# EAGLE design irisc (EAGLE 9.2.2)
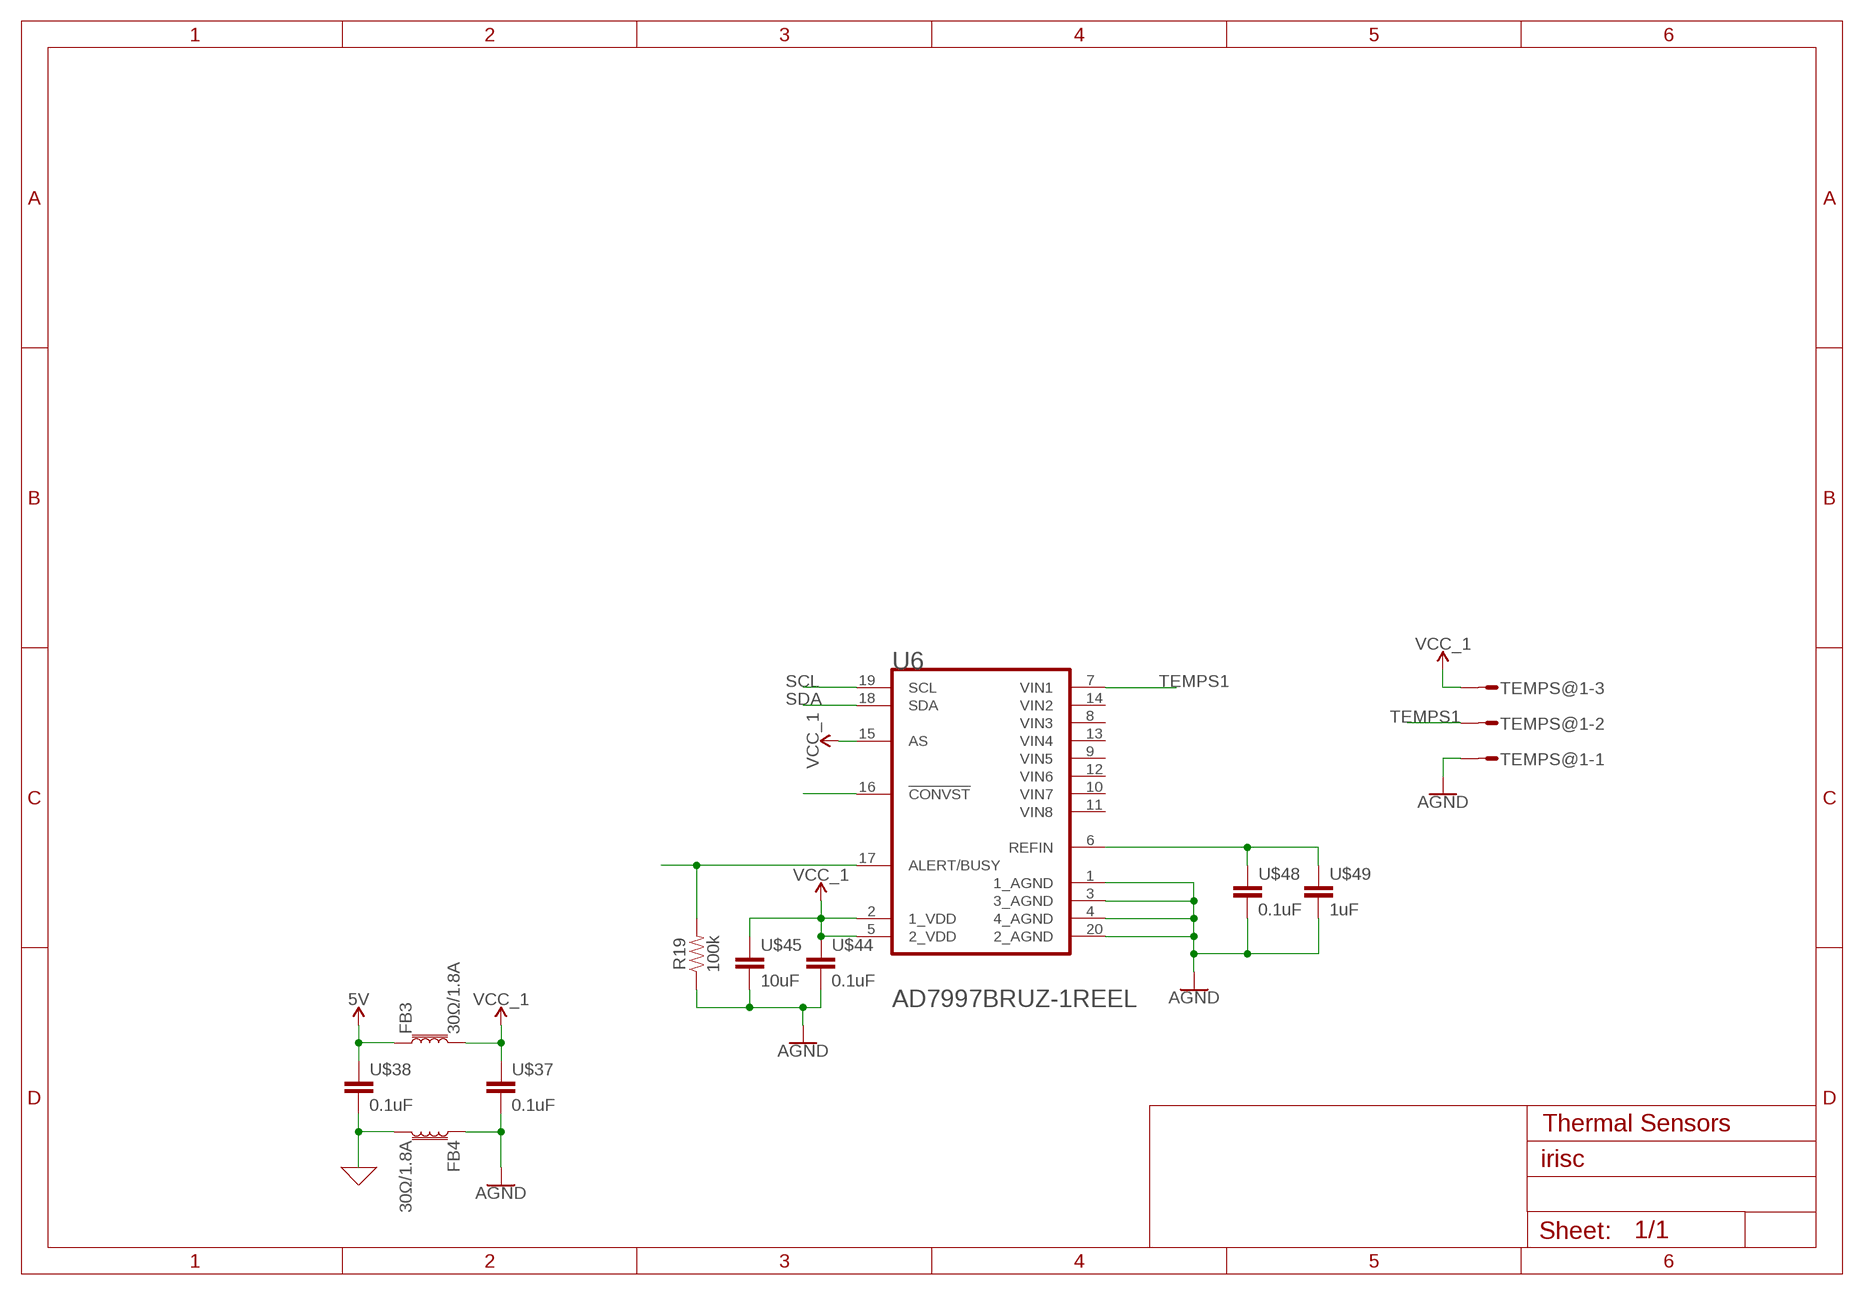
[diagram p0: schematic, sheet 1]

## Parts
FB3  30Ω/1.8A  FERRITE_BEAD-0603  [0603]
FB4  30Ω/1.8A  FERRITE_BEAD-0603  [0603]
R19  100k  100KOHM-0603-1/10W-1%  [0603]
TEMPS@1  L03P  [L03P]
U6  ANALOG_DEVICES_AD7997BRUZ-1REELANALOG_DEVICES_AD7997BRUZ-1REEL_0_0  [ANALOG_DEVICES_AD7997BRUZ-1REEL_0]
U$37  0.1uF  CAPACITOR_0603_N  [RESC0603_N]
U$38  0.1uF  CAPACITOR_0603_N  [RESC0603_N]
U$44  0.1uF  CAPACITOR_0603_N  [RESC0603_N]
U$45  10uF  CAPACITOR_0805_L  [RESC0805_L]
U$48  0.1uF  CAPACITOR_0603_N  [RESC0603_N]
U$49  1uF  CAPACITOR_0603_N  [RESC0603_N]

## Nets
0: FB4.2 U$38.2 ; supply symbol labelled GND
5V: FB3.1 U$38.1
AGND: FB4.1 R19.1 TEMPS@1.1 U6.1(1_AGND) U6.3(3_AGND) U6.4(4_AGND) U6.20(2_AGND) U$37.2 U$44.2 U$45.2 U$48.2 U$49.2
N$63: U6.6(REFIN) U$48.1 U$49.1
N$67: R19.2 U6.17(ALERT/BUSY)
N$68: U6.16(!CONVST!)
SCL: U6.19(SCL)
SDA: U6.18(SDA)
TEMPS1: TEMPS@1.2 U6.7(VIN1)
VCC_1: FB3.2 TEMPS@1.3 U6.2(1_VDD) U6.5(2_VDD) U6.15(AS) U$37.1 U$44.1 U$45.1
Unconnected: U6.8(VIN3) U6.9(VIN5) U6.10(VIN7) U6.11(VIN8) U6.12(VIN6) U6.13(VIN4) U6.14(VIN2)

## Notes on the sheet
- Thermal Sensors

## Library data of the parts
FB3 FB4 = SparkFun-Coils:FERRITE_BEAD: Ferrite Bead (blocks, cores, rings, chokes, etc.) Inductor with layers of ferrite used to suppress high frequencies. Often used to isolate high frequency noise. SparkFun Products: IOIO-OTG - V2.2 <https://www.sparkfun.com/products/13613> SparkFun SAMD21 Mini Breakout <https://www.sparkfun.com/products/13664> SparkFun 6 Degrees of Freedom Breakout - LSM6DS3 <https://www.sparkfun.com/products/13339> SparkFun SAMD21 Dev Breakout <https://www.sparkfun.com/products/13672>; PROD_ID: NDUC-07859
R19 = SparkFun-Resistors:100KOHM: 100kΩ resistor A resistor is a passive two-terminal electrical component that implements electrical resistance as a circuit element. Resistors act to reduce current flow, and, at the same time, act to lower voltage levels within circuits. - Wikipedia; PROD_ID: RES-07828
TEMPS@1 = con-amp-mt:L03P: AMP MT CONNECTOR; OC_FARNELL: unknown; OC_NEWARK: unknown
U6 = Analog Devices - AD7997BRUZ-1REEL:ANALOG_DEVICES_AD7997BRUZ-1REEL: ADI-AD7997-RU-20; CHANNELS: 8; CIIVA_IDS: 4380982; CODE__JEDEC: MO-153AC; COMPONENT_LINK_1_DESCRIPTION: Manufacturer URL; COMPONENT_LINK_1_URL: http://www.analog.com/en/index.html; COMPONENT_LINK_3_DESCRIPTION: Package Specification; COMPONENT_LINK_3_URL: http://www.analog.com/static/imported-files/packages/364515793657813558433715854054607941441RU20.pdf; COMPONENT_LINK_4_DESCRIPTION: Product URL; COMPONENT_LINK_4_URL: http://www.analog.com/en/analog-to-digital-converters/ad-converters/ad7997/products/product.html; DATASHEET: http://www.analog.com/static/imported-files/data_sheets/AD7997_7998.pdf; DATASHEET_VERSION: Rev.0; FOOTPRINT_VARIANT_NAME_0: Level C; FOOTPRINT_VARIANT_NAME_1: Level B; FOOTPRINT_VARIANT_NAME_2: Level A; IMPORTED: yes; IMPORTED_FROM: vault; IMPORT_TS: 1521848429; INTERFACE: I2C/Ser 2-Wire, Ser; MF: Analog Devices; MOUNTING_TECHNOLOGY: Surface Mount; MPN: AD7997BRUZ-1REEL; PACKAGE: RU-20; PACKAGE_DESCRIPTION: 20-Lead Thin Shrink Small Outline Package [TSSOP]; PACKAGE_VERSION: 2000; PACKING: Reel; PREFIX: U; RELEASE_DATE: 1387032128; RESOLUTION_BITS: 10; ROHS: Yes; THROUGHPUT_RATE_SPS: 79K; VAULT_GUID: A7ABE123-3A90-4C1F-BE7E-7FE114D63781; VAULT_REVISION: 98AE87BF-701A-419B-8AC8-345A379FE084
U$37 U$38 U$44 U$45 U$48 U$49 = Nordic_nRF:CAPACITOR: Generic chip capacitor

## Board
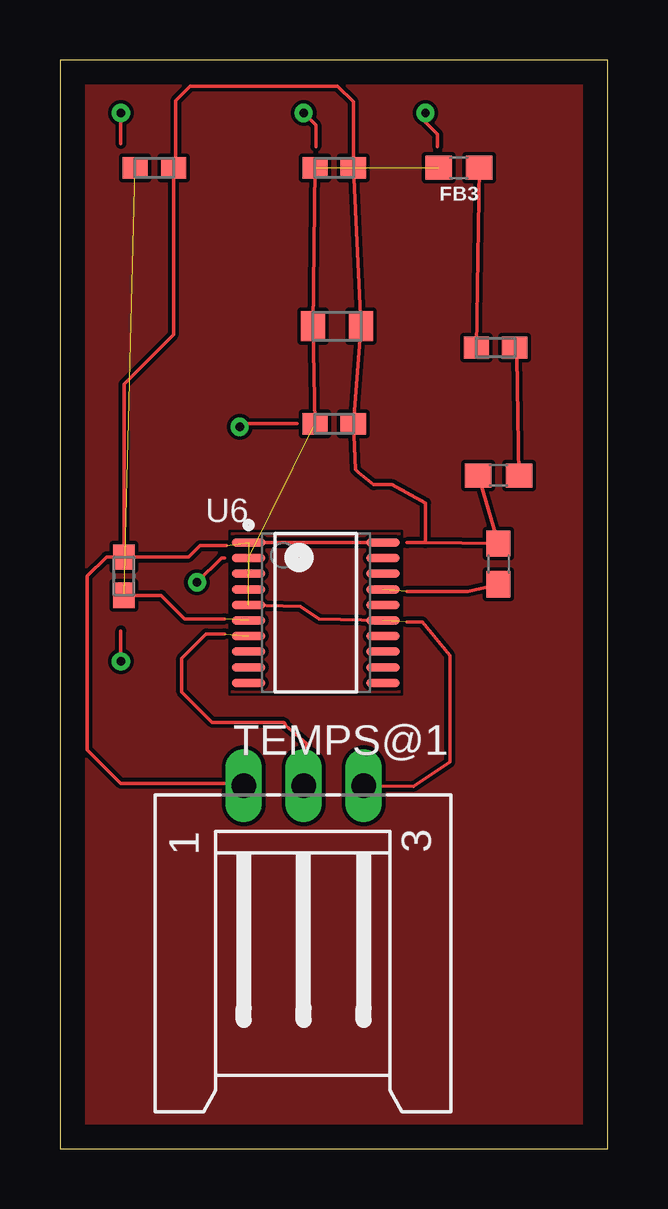
[diagram p1: board, top side]
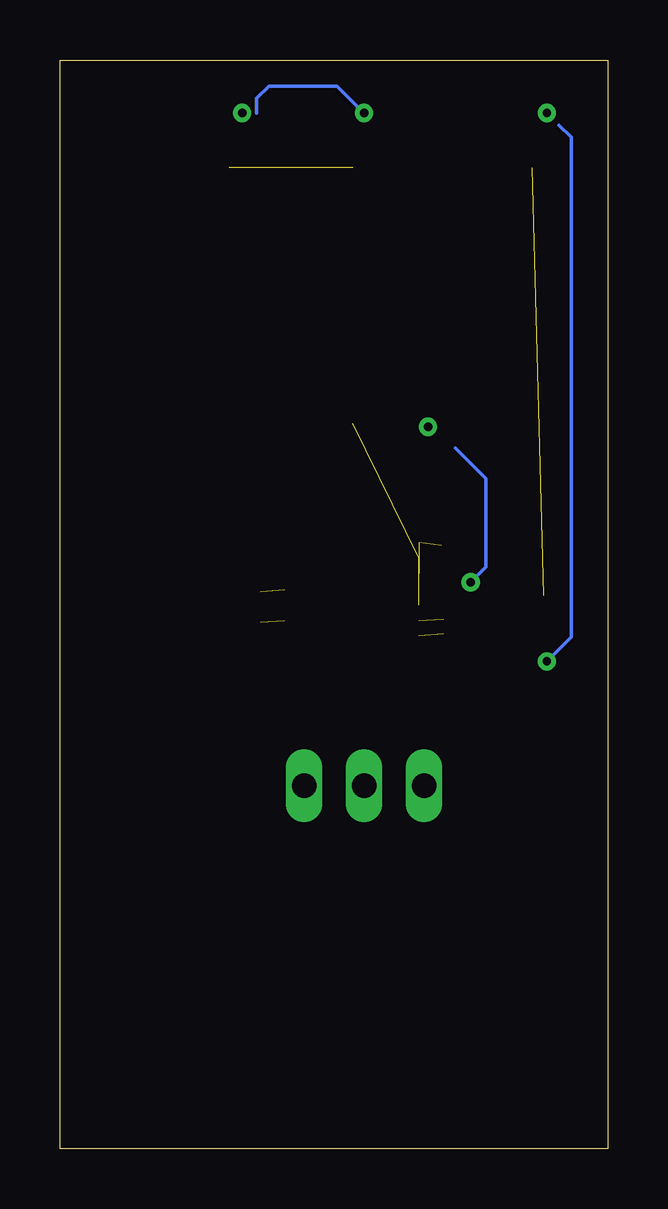
[diagram p2: board, bottom side, seen from below]

Size 22.84 x 45.39 mm. Coordinates in mm from the lower left corner, seen from the top.
Outline: 0,0 22.84,0 22.84,45.39 0,45.39 0,0
Copper layers (1*16): Top 0.035mm / dielectric 1.5mm / Bottom 0.035mm
Design rules "default": minimum track width 6mil, minimum drill 0.35mm, track to track 6mil, track to pad 6mil, pad to pad 6mil, via to via 6mil, smd to smd 6mil, copper to edge 40mil, drill to drill 6mil, minimum pad ring 10mil, minimum via ring 8mil, stop-mask expansion 4mil, vias tented up to drill 0mil, thermal gap 10mil

### Footprints (pad centres in the part's own frame; a part is rotated, then mirrored left to right if it is on the bottom)
0603 = smd 1.1 x 1: 1 -0.85,0; 2 0.85,0
L03P = drill 1.016 long: 1 2.5,-6.25; 2 0,-6.25; 3 -2.5,-6.25
ANALOG_DEVICES_AD7997BRUZ-1REEL_0 = smd 1.4 x 0.35: 1 -2.8,2.925; 2 -2.8,2.275; 3 -2.8,1.625; 4 -2.8,0.975; 5 -2.8,0.325; 6 -2.8,-0.325; 7 -2.8,-0.975; 8 -2.8,-1.625; 9 -2.8,-2.275; 10 -2.8,-2.925; 11 2.8,-2.925; 12 2.8,-2.275; 13 2.8,-1.625; 14 2.8,-0.975; 15 2.8,-0.325; 16 2.8,0.325; 17 2.8,0.975; 18 2.8,1.625; 19 2.8,2.275; 20 2.8,2.925
RESC0603_N = smd 1.05 x 0.9: 1 -0.8,0; 2 0.8,0
RESC0805_L = smd 1 x 1.25: 1 -1,0; 2 1,0

### Placement (x,y rotation side)
FB3  16.64,40.89 180 top
FB4  18.29,28.07 0 top
R19  18.29,24.38 270 top
TEMPS@1  10.16,8.89 180 top
U6  10.67,22.35 0 top
U$37  11.43,40.89 0 top
U$38  18.16,33.4 0 top
U$44  11.43,30.23 0 top
U$45  11.56,34.29 0 top
U$48  3.94,40.89 0 top
U$49  2.67,23.88 90 top

### Tracks (layer width: path | path; a pad name or v marks a point on that pad's centre or on a via)
0
  Top 0.152: FB4.2 19.05,33.02 U$38.2
5V
  Top 0.152: U$38.1 FB3.1
AGND  (3 unrouted)
  Top 0.152: U6.1 U6.20 | 15.24,25.27 R19.1 FB4.1 | 15.24,25.27 14.48,25.27 | 15.24,25.27 15.24,26.92 13.84,27.69 13.08,27.69 12.45,28.19 12.32,28.32 U$44.2 U$45.2 U$37.2 12.23,43.65 11.58,44.3 5.44,44.3 4.83,43.69 4.83,40.98 U$48.2 4.74,33.95 2.67,31.88 U$49.2 | TEMPS@1.1 7.56,15.24 2.54,15.24 1.14,16.64 1.14,23.88 1.94,24.68 U$49.2 | U$49.2 5.37,24.68 5.84,25.15 6.35,25.15 6.94,25.15
GND
  pour Top: 0,0 22.86,0 22.86,45.72 0,45.72
N$1  (via drill 0.35)
  Top 0.152: v5.71,23.62 6.73,24.64 6.86,24.64
  Bottom 0.152: v5.71,23.62 5.08,24.26 5.08,27.94 6.35,29.21
N$2  (via drill 0.35)
  Top 0.152: v7.49,30.1 7.62,30.23 9.88,30.23
N$3  (via drill 0.35)
  Top 0.152: v2.54,20.32 2.54,21.59
  Bottom 0.152: v2.54,20.32 1.52,21.34 1.52,42.16 2.03,42.67
N$4  (via drill 0.35)
  Top 0.152: v2.54,43.18 2.54,41.91
N$5  (via drill 0.35)
  Top 0.152: v10.16,43.18 10.67,42.67 10.67,41.78
  Bottom 0.152: v10.16,43.18 11.28,44.3 14.12,44.3 14.63,43.79 14.63,43.18
N$6  (via drill 0.35)
  Top 0.152: v15.24,43.18 15.24,42.8 15.75,42.29 15.75,41.78
N$63  (2 unrouted)
  Top 0.152: U$49.1 4.23,23.08 5.21,22.1 6.86,22.1
N$67  (1 unrouted)
  Top 0.152: R19.2 17.02,23.24 14.48,23.24
TEMPS1  (1 unrouted)
  Top 0.152: TEMPS@1.2 10.29,16.89 9.4,17.65 arc90 9.27,17.78 6.35,17.78 5.08,19.05 5.08,20.45 6.1,21.46 6.86,21.46
VCC_1  (4 unrouted)
  Top 0.152: U6.5 10.03,22.61 10.79,22.1 U6.15 | U$44.1 U$45.1 U$37.1 | TEMPS@1.3 14.73,15.11 16.26,16.13 16.26,20.57 15.11,21.97 14.48,21.97